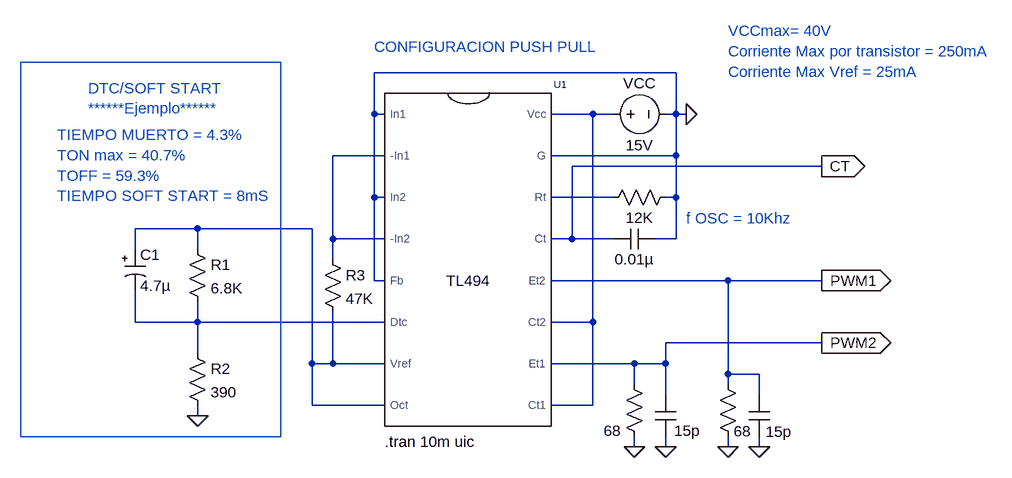
[diagram p0: schematic Ejemplo TL494 - configuracion push pull.asc]
Ejemplo TL494 - configuracion push pull.asc, the LTspice schematic file:
Version 4
SHEET 1 1084 680
WIRE 496 -112 32 -112
WIRE 32 -48 32 -112
WIRE 48 -48 32 -48
WIRE 368 -48 304 -48
WIRE 400 -48 368 -48
WIRE 496 -48 496 -112
WIRE 496 -48 480 -48
WIRE 512 -48 496 -48
WIRE 48 16 -32 16
WIRE 496 16 496 -48
WIRE 496 16 304 16
WIRE 720 32 336 32
WIRE 32 80 32 -48
WIRE 48 80 32 80
WIRE 400 80 304 80
WIRE 496 80 496 16
WIRE 496 80 480 80
WIRE -240 128 -336 128
WIRE -64 128 -240 128
WIRE -32 144 -32 16
WIRE 48 144 -32 144
WIRE 336 144 336 32
WIRE 336 144 304 144
WIRE 400 144 336 144
WIRE 496 144 496 80
WIRE 496 144 464 144
WIRE -336 160 -336 128
WIRE -240 160 -240 128
WIRE -32 176 -32 144
WIRE 32 208 32 80
WIRE 48 208 32 208
WIRE 576 208 304 208
WIRE 720 208 576 208
WIRE -336 272 -336 224
WIRE -240 272 -240 240
WIRE -240 272 -336 272
WIRE 48 272 -240 272
WIRE 368 272 368 -48
WIRE 368 272 304 272
WIRE 720 304 480 304
WIRE -240 320 -240 272
WIRE -64 336 -64 128
WIRE -32 336 -32 256
WIRE -32 336 -64 336
WIRE 48 336 -32 336
WIRE 432 336 304 336
WIRE 480 336 480 304
WIRE 480 336 432 336
WIRE 576 352 576 208
WIRE 624 352 576 352
WIRE 432 368 432 336
WIRE 576 368 576 352
WIRE 480 384 480 336
WIRE 624 384 624 352
WIRE -64 400 -64 336
WIRE 48 400 -64 400
WIRE 368 400 368 272
WIRE 368 400 304 400
WIRE -240 416 -240 400
WIRE 432 464 432 448
WIRE 480 464 480 448
WIRE 576 464 576 448
WIRE 624 464 624 448
FLAG -240 416 0
FLAG 512 -48 0
FLAG 432 464 0
FLAG 480 464 0
FLAG 576 464 0
FLAG 624 464 0
FLAG 720 208 PWM1
IOPIN 720 208 Out
FLAG 720 304 PWM2
IOPIN 720 304 Out
FLAG 720 32 CT
IOPIN 720 32 Out
SYMBOL tl494 176 208 R0
SYMATTR InstName U1
SYMBOL res -256 144 R0
SYMATTR InstName R1
SYMATTR Value 6.8K
SYMBOL res -256 304 R0
SYMATTR InstName R2
SYMATTR Value 390
SYMBOL polcap -352 160 R0
SYMATTR InstName C1
SYMATTR Value 4.7µ
SYMBOL res -48 160 R0
SYMATTR InstName R3
SYMATTR Value 47K
SYMBOL voltage 384 -48 M90
WINDOW 0 -32 56 VBottom 0
WINDOW 3 32 56 VTop 0
WINDOW 123 0 0 Left 0
WINDOW 39 0 0 Left 0
SYMATTR InstName VCC
SYMATTR Value 15V
SYMBOL cap 464 128 R90
WINDOW 0 0 32 Invisible 0
WINDOW 3 32 32 VTop 0
SYMATTR InstName C2
SYMATTR Value 0.01µ
SYMBOL res 496 64 R90
WINDOW 0 0 56 Invisible 0
WINDOW 3 32 56 VTop 0
SYMATTR InstName R4
SYMATTR Value 12K
SYMBOL res 416 352 R0
WINDOW 0 36 40 Invisible 0
WINDOW 3 -31 87 Left 0
SYMATTR InstName R5
SYMATTR Value 68
SYMBOL cap 464 384 R0
WINDOW 0 24 8 Invisible 0
WINDOW 3 29 55 Left 0
SYMATTR InstName C3
SYMATTR Value 15p
SYMBOL res 560 352 R0
WINDOW 0 36 40 Invisible 0
WINDOW 3 25 88 Left 0
SYMATTR InstName R6
SYMATTR Value 68
SYMBOL cap 608 384 R0
WINDOW 0 24 8 Invisible 0
WINDOW 3 26 57 Left 0
SYMATTR InstName C4
SYMATTR Value 15p
TEXT 48 456 Left 0 !.tran 10m uic
TEXT 32 -152 Left 0 ;CONFIGURACION PUSH PULL
TEXT -408 -88 Left 0 ;DTC/SOFT START\n******Ejemplo******
TEXT -456 -16 Left 0 ;TIEMPO MUERTO = 4.3%\nTON max = 40.7%\nTOFF = 59.3%\nTIEMPO SOFT START = 8mS
TEXT 512 112 Left 0 ;f OSC = 10Khz
TEXT 576 -176 Left 0 ;VCCmax= 40V\nCorriente Max por transistor = 250mA\nCorriente Max Vref = 25mA
RECTANGLE Normal -112 448 -512 -128

The netlist it stands for:
* Ejemplo TL494 - configuracion push pull.asc
XU1 0 N002 0 N002 0 N005 N004 N004 N001 PWM2 N001 PWM1 CT N003 0 N001 TL494 TL494  ; pins In1 -In1 In2 -In2 Fb Dtc Vref Oct Ct1 Et1 Ct2 Et2 Ct Rt G Vcc
R1 N004 N005 6.8K
R2 N005 0 390
C1 N004 N005 4.7µ
R3 N002 N004 47K
VCC N001 0 15V
C2 0 CT 0.01µ
R4 0 N003 12K
R5 PWM2 0 68
C3 PWM2 0 15p
R6 PWM1 0 68
C4 PWM1 0 15p
.tran 10m uic
* CONFIGURACION PUSH PULL
* DTC/SOFT START
* ******Ejemplo******
* TIEMPO MUERTO = 4.3%
* TON max = 40.7%
* TOFF = 59.3%
* TIEMPO SOFT START = 8mS
* f OSC = 10Khz
* VCCmax= 40V
* Corriente Max por transistor = 250mA
* Corriente Max Vref = 25mA
.lib tl494.sub
.backanno
.end